# Altium schematic sheet PCA_0006_Mini_CB_Mech_REV_B.SchDoc
size A4; DrawnBy: Philip Rowse
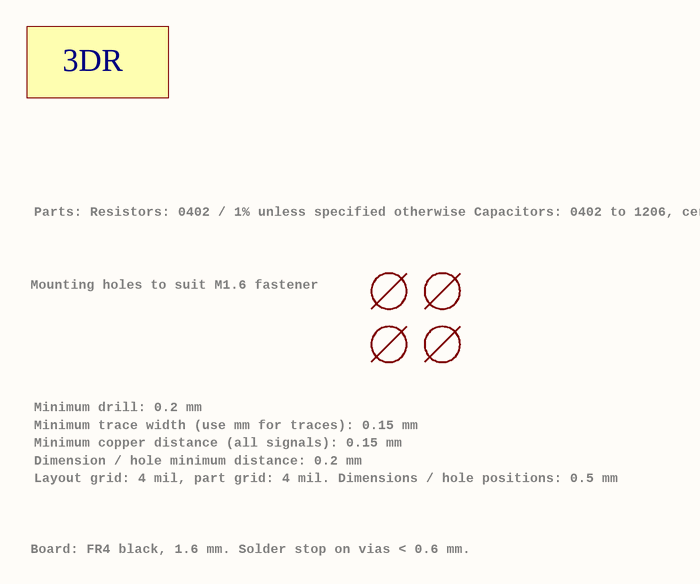
[diagram p0: PCA_0006_Mini_CB_Mech_REV_B.SchDoc]

## Parts
LOGO_3DR  DO NOT FIT  [3DR_SMALL]  (value not drawn)
M3_MOUNT901  MOUNT-HOLE1.8MM  [MOUNT-HOLE1.8]  (value not drawn)
M3_MOUNT902  MOUNT-HOLE1.8MM  [MOUNT-HOLE1.8]  (value not drawn)
M3_MOUNT903  MOUNT-HOLE1.8MM  [MOUNT-HOLE1.8]  (value not drawn)
M3_MOUNT904  MOUNT-HOLE1.8MM  [MOUNT-HOLE1.8]  (value not drawn)

## Notes on the sheet
- Parts:
  Resistors: 0402 / 1% unless specified otherwise
  Capacitors: 0402 to 1206, ceramic, voltage rating: 10V unless specified
- Mounting holes to suit M1.6 fastener
- Minimum drill: 0.2 mm
- Minimum trace width (use mm for traces): 0.15 mm
- Minimum copper distance (all signals): 0.15 mm
- Dimension / hole minimum distance: 0.2 mm
- Layout grid: 4 mil, part grid: 4 mil. Dimensions / hole positions: 0.5 mm
- Board: FR4 black, 1.6 mm. Solder stop on vias < 0.6 mm.
- This licence Applies to this doccument ONLY, other components that make up the full system come with their own licences, please check with the Author for further information
- To the extent possible under law, Philip Rowse and 3DRobotics has waived all copyright and related or neighboring
- rights to Carrier board for APM 3.0 series. This work is published from: United States, and Australia
- Title:
- Date:
- Time:
- For information on this Licence: http://creativecommons.org/publicdomain/zero/1.0/
- Sheet:
- Approved:
- of:
- Drawn By:
- Checked By:
- 3DRobotics
- (in symbol 3DR Logo) 3DR

## Library data of the parts
LOGO_3DR = 3DR Logo
M3_MOUNT901-M3_MOUNT904 = MOUNT-HOLE1.8MM: DO NOT FIT